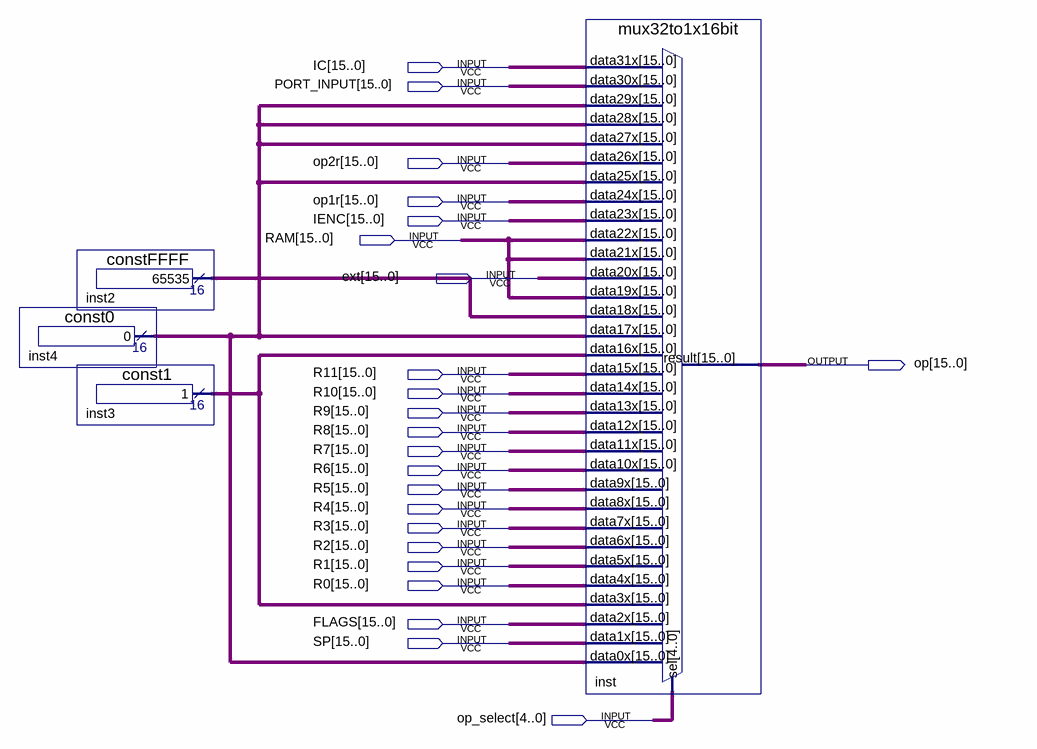
[diagram p0: schematic sheet]
// Quartus schematic OPSELECT.bdf as structural Verilog: 4 symbols, 23 pins
module OPSELECT (
  input  [15:0] IC,
  input  [15:0] PORT_INPUT,
  input  [15:0] op2r,
  input  [15:0] op1r,
  input  [15:0] IENC,
  input  [15:0] RAM,
  input  [15:0] ext,
  input  [15:0] R11,
  input  [15:0] R10,
  input  [15:0] R9,
  input  [15:0] R8,
  input  [15:0] R7,
  input  [15:0] R6,
  input  [15:0] R5,
  input  [15:0] R4,
  input  [15:0] R3,
  input  [15:0] R2,
  input  [15:0] R1,
  input  [15:0] R0,
  input  [15:0] FLAGS,
  input  [15:0] SP,
  input  [4:0] op_select,
  output [15:0] op
);

  wire [15:0] inst2_result, inst3_result, inst4_result;

  constFFFF inst2 (.result(inst2_result));
  const0 inst4 (.result(inst4_result));
  const1 inst3 (.result(inst3_result));
  mux32to1x16bit inst (
    .data31x(IC), .data30x(PORT_INPUT), .data29x(inst4_result), .data28x(inst4_result),
    .data27x(inst4_result), .data26x(op2r), .data25x(inst4_result), .data24x(op1r), .data23x(IENC),
    .data22x(RAM), .data21x(RAM), .data20x(ext), .data19x(RAM), .data18x(inst2_result),
    .data17x(inst4_result), .data16x(inst3_result), .data15x(R11), .data14x(R10), .data13x(R9), .data12x(R8),
    .data11x(R7), .data10x(R6), .data9x(R5), .data8x(R4), .data7x(R3), .data6x(R2), .data5x(R1), .data4x(R0),
    .data3x(inst3_result), .data2x(FLAGS), .data1x(SP), .data0x(inst4_result), .sel(op_select), .result(op));
endmodule
